# EAGLE design guitar_base (EAGLE 8.3.1)
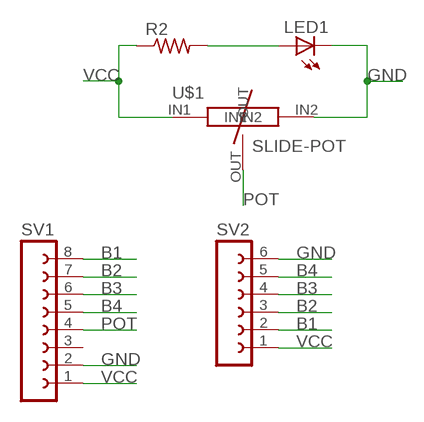
[diagram p0: schematic, sheet 1]

## Parts
LED1  LED5MM  [LED5MM]
R2  R-US_0207/7  [0207/7]
SV1  FE08-1  [FE08]
SV2  FE06-1  [FE06]
U$1  SLIDE-POT  [SLIDE-POT]

## Nets
B1: SV1.8 SV2.2
B2: SV1.7 SV2.3
B3: SV1.6 SV2.4
B4: SV1.5 SV2.5
GND: LED1.K(C) SV1.2 SV2.6 U$1.IN2
N$1: LED1.A R2.2
POT: SV1.4 U$1.OUT
VCC: R2.1 SV1.1 SV2.1 U$1.IN1
Unconnected: SV1.3

## Library data of the parts
LED1 = led:LED: LED OSRAM: - CHIPLED LG R971, LG N971, LY N971, LG Q971, LY Q971, LO R971, LY R971 LH N974, LH R974 LS Q976, LO Q976, LY Q976 LO Q996 - Hyper CHIPLED LW Q18S LB Q993, LB Q99A, LB R99A - SideLED LS A670, LO A670, LY A670, LG A670, LP A670 LB A673, LV A673, LT A673, LW A673 LH A674 LY A675 LS A676, LA A676, LO A676, LY A676, LW A676 LS A679, LY A679, LG A679 - Hyper Micro SIDELED® LS Y876, LA Y876, LO Y876, LY Y876 LT Y87S - SmartLED LW L88C, LW L88S LB L89C, LB L89S, LG L890 LS L89K, LO L89K, LY L89K LS L896, LA L896, LO L896, LY L896 - TOPLED LS T670, LO T670, LY T670, LG T670, LP T670 LSG T670, LSP T670, LSY T670, LOP T670, LYG T670 LG T671, LOG T671, LSG T671 LB T673, LV T673, LT T673, LW T673 LH T674 LS T676, LA T676, LO T676, LY T676, LB T676, LH T676, LSB T676, LW T676 LB T67C, LV T67C, LT T67C, LS T67K, LO T67K, LY T67K, LW E67C LS E67B, LA E67B, LO E67B, LY E67B, LB E67C, LV E67C, LT E67C LW T67C LS T679, LY T679, LG T679 LS T770, LO T770, LY T770, LG T770, LP T770 LB T773, LV T773, LT T773, LW T773 LH T774 LS E675, LA E675, LY E675, LS T675 LS T776, LA T776, LO T776, LY T776, LB T776 LHGB T686 LT T68C, LB T68C - Hyper Mini TOPLED® LB M676 - Mini TOPLED Santana® LG M470 LS M47K, LO M47K, LY M47K Source: http://www.osram.convergy.de LUXEON: - LUMILED® LXK2-PW12-R00, LXK2-PW12-S00, LXK2-PW14-U00, LXK2-PW14-V00 LXK2-PM12-R00, LXK2-PM12-S00, LXK2-PM14-U00 LXK2-PE12-Q00, LXK2-PE12-R00, LXK2-PE12-S00, LXK2-PE14-T00, LXK2-PE14-U00 LXK2-PB12-K00, LXK2-PB12-L00, LXK2-PB12-M00, LXK2-PB14-N00, LXK2-PB14-P00, LXK2-PB14-Q00 LXK2-PR12-L00, LXK2-PR12-M00, LXK2-PR14-Q00, LXK2-PR14-R00 LXK2-PD12-Q00, LXK2-PD12-R00, LXK2-PD12-S00 LXK2-PH12-R00, LXK2-PH12-S00 LXK2-PL12-P00, LXK2-PL12-Q00, LXK2-PL12-R00 Source: www.luxeon.com KINGBRIGHT: KA-3528ASYC Source: www.kingbright.com
R2 = rcl:R-US_: RESISTOR, American symbol
SV1 = con-lsta:FE08-1: FEMALE HEADER; OC_FARNELL: unknown; OC_NEWARK: unknown
SV2 = con-lsta:FE06-1: FEMALE HEADER; OC_FARNELL: unknown; OC_NEWARK: unknown
U$1 = 319k:SLIDE-POT

## Board
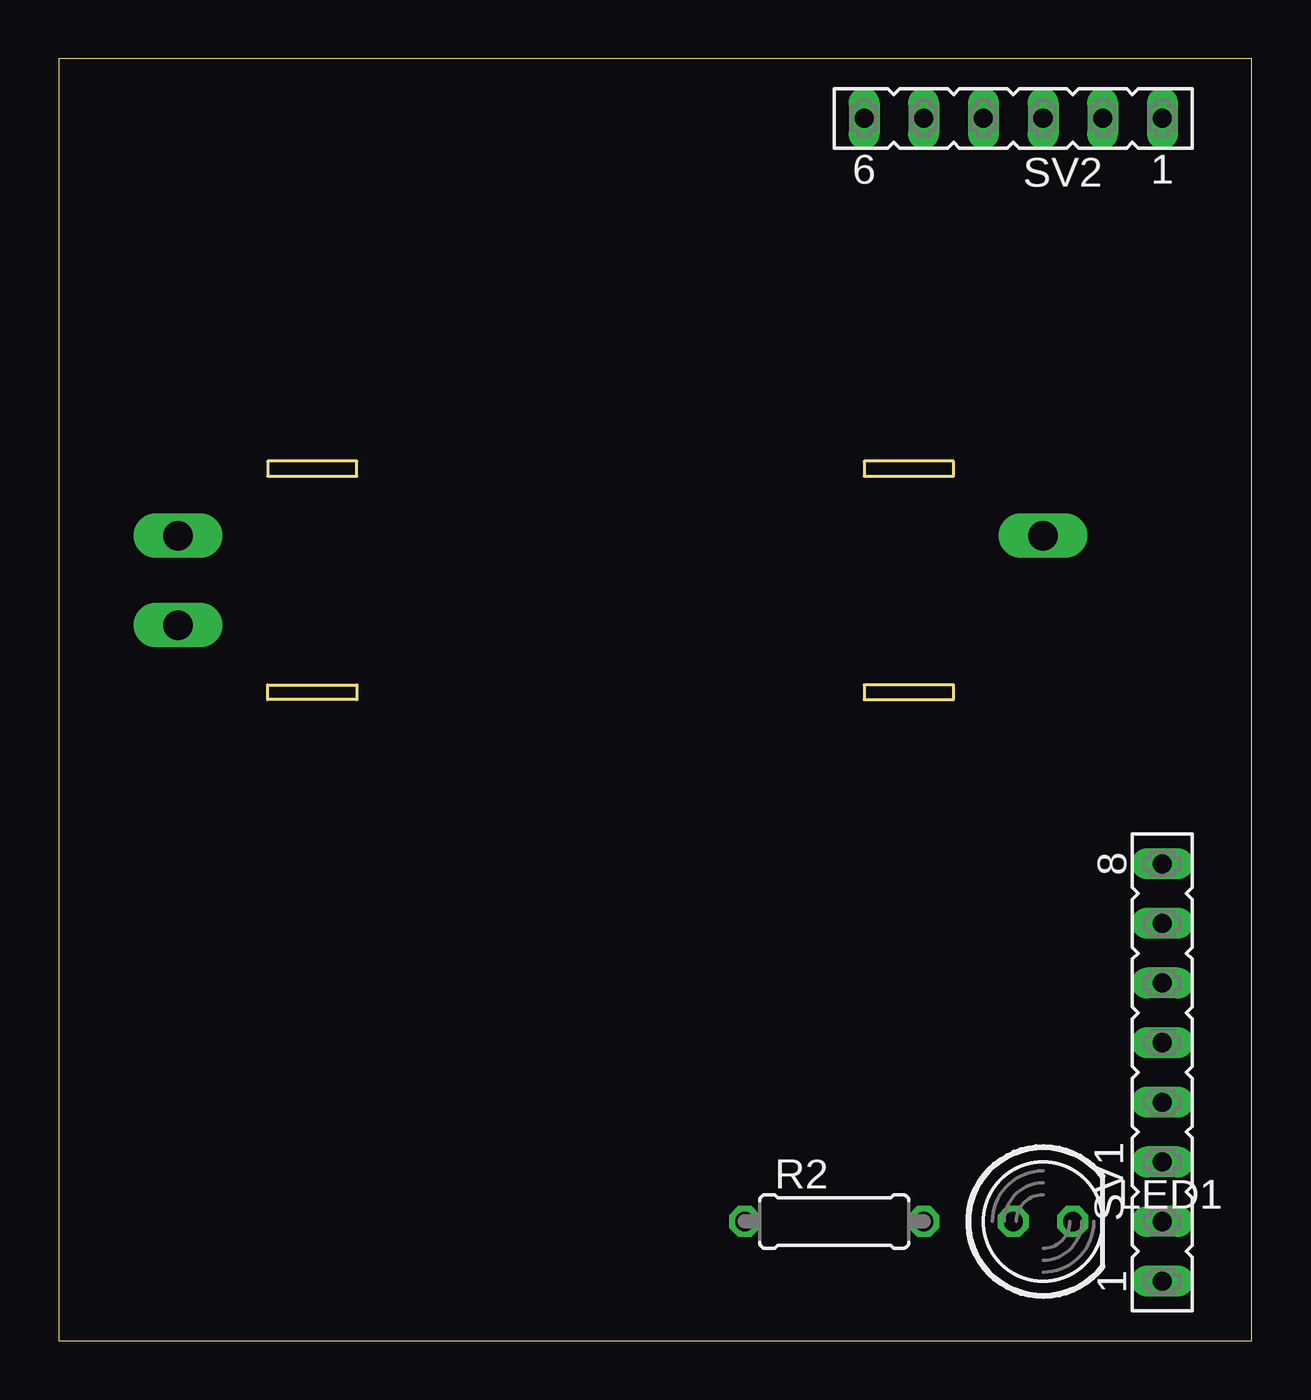
[diagram p1: board, top side]
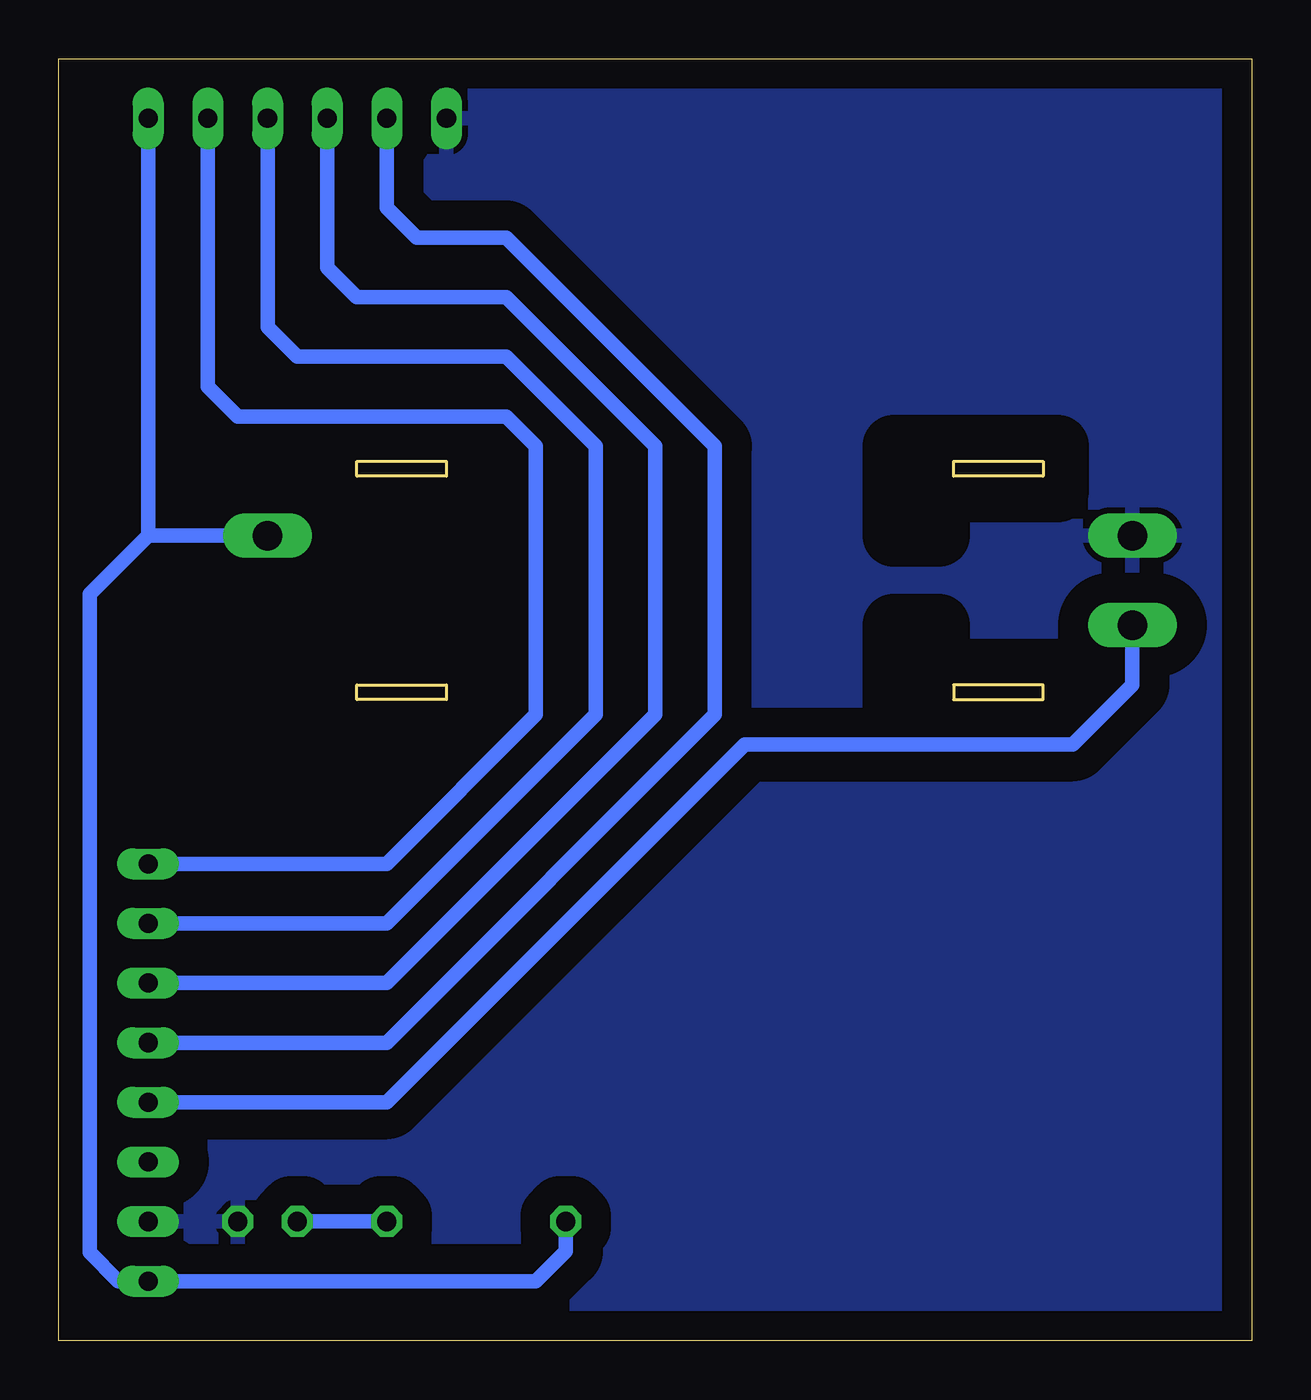
[diagram p2: board, bottom side, seen from below]

Size 50.8 x 54.61 mm. Coordinates in mm from the lower left corner, seen from the top.
Outline: 0,0 50.8,0 50.8,54.61 0,54.61 0,0
Copper layers (1*16): Top 0.035mm / dielectric 1.5mm / Bottom 0.035mm
Design rules "default": minimum track width 6mil, minimum drill 0.35mm, track to track 6mil, track to pad 6mil, pad to pad 6mil, via to via 6mil, smd to smd 6mil, copper to edge 40mil, drill to drill 6mil, minimum pad ring 10mil, minimum via ring 8mil, stop-mask expansion 4mil, vias tented up to drill 0mil, thermal gap 10mil

### Footprints (pad centres in the part's own frame; a part is rotated, then mirrored left to right if it is on the bottom)
LED5MM = drill 0.813 octagon: A -1.27,0; K 1.27,0
0207/7 = drill 0.813 octagon: 1 -3.81,0; 2 3.81,0
FE08 = drill 0.813 long: 1 -8.89,0; 2 -6.35,0; 3 -3.81,0; 4 -1.27,0; 5 1.27,0; 6 3.81,0; 7 6.35,0; 8 8.89,0
FE06 = drill 0.813 long: 1 -6.35,0; 2 -3.81,0; 3 -1.27,0; 4 1.27,0; 5 3.81,0; 6 6.35,0
SLIDE-POT = drill 1.27 long: IN1 -36.83,-3.81; IN2 0,-3.81; OUT 0,0

### Placement (x,y rotation side)
LED1  41.91,5.08 0 top
R2  33.02,5.08 0 top
SV1  46.99,11.43 90 top
SV2  40.64,52.07 180 top
U$1  5.08,30.48 180 top

### Tracks (layer width: path | path; a pad name or v marks a point on that pad's centre or on a via)
B1
  Bottom 0.61: SV1.8 36.83,20.32 30.48,26.67 30.48,38.1 31.75,39.37 43.18,39.37 44.45,40.64 SV2.2
B2
  Bottom 0.61: SV1.7 36.83,17.78 29.21,25.4 27.94,26.67 27.94,38.1 31.75,41.91 40.64,41.91 41.91,43.18 SV2.3
B3
  Bottom 0.61: SV1.6 36.83,15.24 25.4,26.67 25.4,38.1 31.75,44.45 38.1,44.45 39.37,45.72 SV2.4
B4
  Bottom 0.61: SV1.5 36.83,12.7 22.86,26.67 22.86,38.1 31.75,46.99 35.56,46.99 36.83,48.26 SV2.5
GND
  pour Bottom (isolate 1.27): 0,54.61 0,0 50.8,0 50.8,54.61
N$1
  Bottom 0.61: LED1.A R2.2
POT
  Bottom 0.61: SV1.4 36.83,10.16 21.59,25.4 7.62,25.4 5.08,27.94 U$1.OUT
VCC
  Bottom 0.61: 46.99,34.29 49.48,31.8 49.48,3.76 48.26,2.54 SV1.1 30.48,2.54 29.21,3.81 R2.1 | 46.99,34.29 SV2.1 | U$1.IN1 46.99,34.29